# Altium schematic sheet Lora.SchDoc
size A
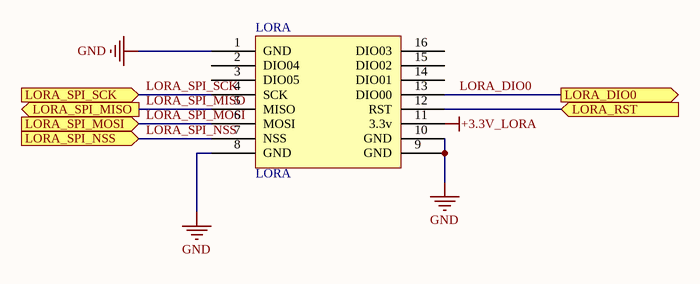
[diagram p0: Lora.SchDoc]

## Parts
LORA  LORA  [LORA-RA2-SMD]

## Ports
LORA_DIO0 (out), LORA_RST (in), LORA_SPI_MISO (out), LORA_SPI_MOSI (in), LORA_SPI_NSS (in), LORA_SPI_SCK (in)

## Nets
+3.3V_LORA: LORA.11(3.3v)
GND: LORA.1(GND) LORA.8(GND) LORA.9(GND) LORA.10(GND)
LORA_DIO0: LORA.13(DIO00) ; port LORA_DIO0
LORA_RST: LORA.12(RST) ; port LORA_RST
LORA_SPI_MISO: LORA.5(MISO) ; port LORA_SPI_MISO
LORA_SPI_MOSI: LORA.6(MOSI) ; port LORA_SPI_MOSI
LORA_SPI_NSS: LORA.7(NSS) ; port LORA_SPI_NSS
LORA_SPI_SCK: LORA.4(SCK) ; port LORA_SPI_SCK

Not connected (* = marked no-connect by the designer): LORA 2(DIO04) 3(DIO05) 14(DIO01) 15(DIO02) 16(DIO03)